# Altium schematic sheet Boost.SchDoc
size A4; SheetNumber: 3; SheetTotal: 6
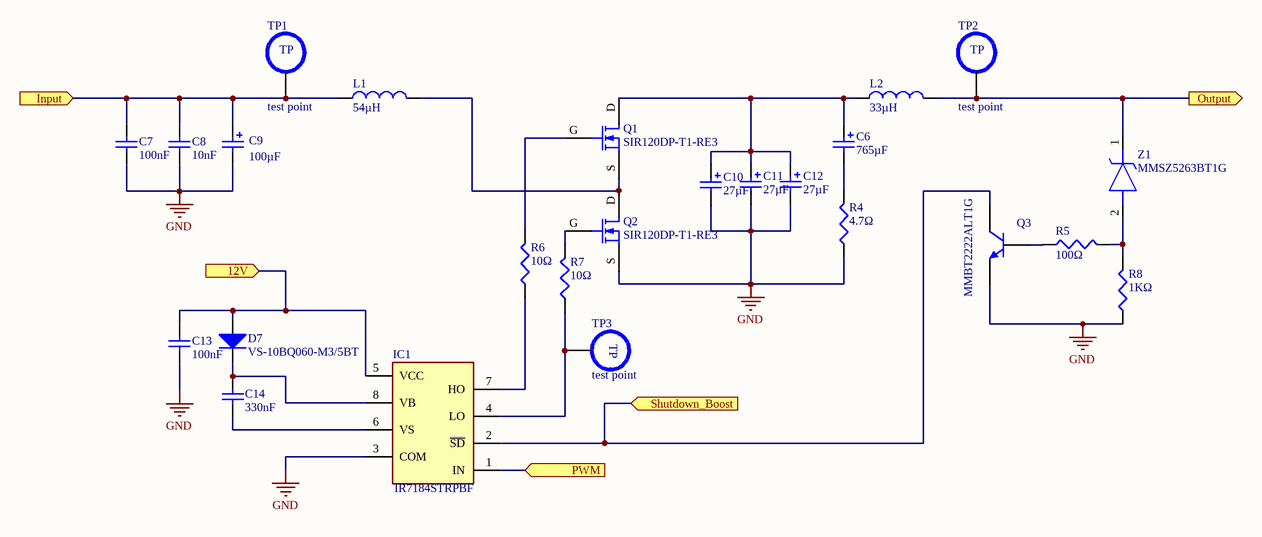
[diagram p0: Boost.SchDoc]

## Parts
C6  765µF  [EEE0JA471UAP]
C7  100nF  [CAPC3216X180N]
C8  10nF  [CAPC3216X180N]
C9  100µF  [EEE0JA471UAP]
C10  27µF  [EEE0JA471UAP]
C11  27µF  [EEE0JA471UAP]
C12  27µF  [EEE0JA471UAP]
C13  100nF  [CAPC3216X180N]
C14  330nF  [CAPC3216X180N]
D7  VS-10BQ060-M3/5BT  [DIOM5436X244N]
IC1  IR7184STRPBF  [SOIC127P600X175-8N]
L1  54µH  [SHBC201R7A0152V]
L2  33µH  [INDPM125125X850N]
Q1  SIR120DP-T1-RE3  [SI7141DPT1GE3]
Q2  SIR120DP-T1-RE3  [SI7141DPT1GE3]
Q3  MMBT2222ALT1G  [SOT96P237X111-3N]
R4  4.7Ω  [RESC3216X75N]
R5  100Ω  [RESC3216X75N]
R6  10Ω  [RESC3216X75N]
R7  10Ω  [RESC3216X75N]
R8  1KΩ  [RESC3216X75N]
TP1  test point  [Test point]
TP2  test point  [Test point]
TP3  test point  [Test point]
Z1  MMSZ5263BT1G  [SOD3716X135N]

## Ports
12V (in), Input (in), Output (out), PWM (in), Shutdown_Boost (in)

## Nets
GND: C7.1 C8.1 C9.2 C10.2 C11.2 C12.2 C13.1 IC1.3(COM) Q2.S Q3.3(E) R4.1 R8.1
12V: C13.2 D7.1(A) IC1.5(VCC) ; port 12V
Input: C7.2 C8.2 C9.1 L1.1 TP1.5 ; port Input
Output: L2.2 TP2.5 Z1.1(K) ; port Output
PWM: IC1.1(IN) ; port PWM
Shutdown_Boost: IC1.2(~{SD}) Q3.1(C) ; port Shutdown_Boost
NetC6_1: C6.1 C10.1 C11.1 C12.1 L2.1 Q1.D
NetC6_2: C6.2 R4.2
NetC14_1: C14.1 IC1.6(VS)
NetC14_2: C14.2 D7.2(K) IC1.8(VB)
NetIC1_4: IC1.4(LO) R7.1 TP3.5
NetIC1_7: IC1.7(HO) R6.1
NetL1_2: L1.2 Q1.S Q2.D
NetQ1_G: Q1.G R6.2
NetQ2_G: Q2.G R7.2
NetQ3_2: Q3.2(B) R5.1
NetR5_2: R5.2 R8.2 Z1.2(A)

## Notes on the sheet
- (in symbol test point) TP

## Library data of the parts
C6 = 765µF: Capacitor Polarised; Manufacturer_Name: Panasonic; Manufacturer_Part_Number: EEV-FK1K101V; Datasheet Link: http://industrial.panasonic.com/cdbs/www-data/pdf/RDE0000/ABA0000C1181.pdf; Height: 14.3mm; Mouser Part Number: 667-EEV-FK1K101V; Mouser Price/Stock: https://www.mouser.co.uk/ProductDetail/Panasonic/EEV-FK1K101V?qs=MtOUKumLmnbTFvRMlB7%2FdA%3D%3D; Value: 765µF
C7 C13 = 100nF: Capacitor; Published: 8-Jun-2000; LatestRevisionDate: 17-Jul-2002; LatestRevisionNote: Re-released for DXP Platform.; PackageReference: RAD-0.3; Publisher: Altium Limited; PackageDescription: Radial Cap, Thru-Hole; 2 Leads; 0.3 in Pin Spacing; Value: 100nF
C8 = 10nF: Capacitor; Published: 8-Jun-2000; LatestRevisionDate: 17-Jul-2002; LatestRevisionNote: Re-released for DXP Platform.; PackageReference: RAD-0.3; Publisher: Altium Limited; PackageDescription: Radial Cap, Thru-Hole; 2 Leads; 0.3 in Pin Spacing; Value: 10nF
C9 = 100µF: Capacitor Polarised; Manufacturer_Name: Panasonic; Manufacturer_Part_Number: EEV-FK1K101V; Datasheet Link: http://industrial.panasonic.com/cdbs/www-data/pdf/RDE0000/ABA0000C1181.pdf; Height: 14.3mm; Mouser Part Number: 667-EEV-FK1K101V; Mouser Price/Stock: https://www.mouser.co.uk/ProductDetail/Panasonic/EEV-FK1K101V?qs=MtOUKumLmnbTFvRMlB7%2FdA%3D%3D
C10-C12 = 27µF: Capacitor Polarised; Manufacturer_Name: Panasonic; Manufacturer_Part_Number: EEV-FK1K101V; Datasheet Link: http://industrial.panasonic.com/cdbs/www-data/pdf/RDE0000/ABA0000C1181.pdf; Height: 14.3mm; Mouser Part Number: 667-EEV-FK1K101V; Mouser Price/Stock: https://www.mouser.co.uk/ProductDetail/Panasonic/EEV-FK1K101V?qs=MtOUKumLmnbTFvRMlB7%2FdA%3D%3D; Value: 27µF
C14 = 330nF: Capacitor; Published: 8-Jun-2000; LatestRevisionDate: 17-Jul-2002; LatestRevisionNote: Re-released for DXP Platform.; PackageReference: RAD-0.3; Publisher: Altium Limited; PackageDescription: Radial Cap, Thru-Hole; 2 Leads; 0.3 in Pin Spacing; Value: 330nF
D7 = Diode: Default Diode; Published: 8-Jun-2000; LatestRevisionDate: 17-Jul-2002; LatestRevisionNote: Re-released for DXP Platform.; PackageVersion: Sep-1996; PackageReference: SMC; Publisher: Altium Limited; PackageDescription: DO-214-AB/SMC; 2 C-Bend Leads; Body 7.9 x 5.9 mm, inc. leads (LxW); Code_JEDEC: DO-214-AB
IC1 = IR7184STRPBF: Integrated Circuit; Manufacturer_Name: Infineon; Datasheet Link: https://componentsearchengine.com/Datasheets/1/IR7184STRPBF.pdf; Height: 1.75mm; Manufacturer_Part_Number: IR7184STRPBF; Mouser Part Number: 942-IR7184STRPBF; Mouser Price/Stock: https://www.mouser.com/Search/Refine.aspx?Keyword=942-IR7184STRPBF; Arrow Part Number: IR7184STRPBF; Arrow Price/Stock: https://www.arrow.com/en/products/ir7184strpbf/infineon-technologies-ag
L1 = 54µH: power inductor
L2 = 33µH: power inductor
Q1 Q2 = SIR120DP-T1-RE3: MOSFET (N-Channel); Manufacturer_Name: Vishay; Datasheet Link: http://www.vishay.com/docs/79731/sir120dp.pdf; Manufacturer_Part_Number: SIR120DP-T1-RE3; Mouser Part Number: 78-SIR120DP-T1-RE3; Mouser Price/Stock: https://www.mouser.co.uk/ProductDetail/Vishay-Semiconductors/SIR120DP-T1-RE3?qs=UkDUCjYnTB3xEXzKpvDZuA%3D%3D; Arrow Part Number: SIR120DP-T1-RE3; Arrow Price/Stock: https://www.arrow.com/en/products/sir120dp-t1-re3/vishay
Q3 = NPN: NPN Bipolar Transistor; Published: 8-Jun-2000; LatestRevisionDate: 17-Jul-2002; LatestRevisionNote: Re-released for DXP Platform.; PackageReference: TO-226-AA; Publisher: Altium Limited; PackageDescription: TO, Flat Index; 3 In-Line, Axial Leads; Body Dia. 4.8mm; Leads 0.55 x 0.51 mm (max); Code_JEDEC: TO-226-AA
R4 = 4.7Ω: Resistor; Published: 8-Jun-2000; LatestRevisionDate: 29-May-2009; LatestRevisionNote: IPC-7351 Footprint Added.; PackageReference: J1-0603; Publisher: Altium Limited; PackageDescription: Chip Resistor
R5 = 100Ω: Resistor; Published: 8-Jun-2000; LatestRevisionDate: 29-May-2009; LatestRevisionNote: IPC-7351 Footprint Added.; PackageReference: J1-0603; Publisher: Altium Limited; PackageDescription: Chip Resistor
R6 R7 = 10Ω: Resistor; Published: 8-Jun-2000; LatestRevisionDate: 29-May-2009; LatestRevisionNote: IPC-7351 Footprint Added.; PackageReference: J1-0603; Publisher: Altium Limited; PackageDescription: Chip Resistor
R8 = 1KΩ: Resistor; Published: 8-Jun-2000; LatestRevisionDate: 29-May-2009; LatestRevisionNote: IPC-7351 Footprint Added.; PackageReference: J1-0603; Publisher: Altium Limited; PackageDescription: Chip Resistor
Z1 = MMSZ5263BT1G: Zener Diode; Manufacturer_Name: ON Semiconductor; Datasheet Link: http://www.onsemi.com/pub/Collateral/MMSZ5221BT1-D.PDF; Height: 1.35mm; Manufacturer_Part_Number: MMSZ5263BT1G; Mouser Part Number: 863-MMSZ5263BT1G; Mouser Price/Stock: https://www.mouser.co.uk/ProductDetail/onsemi/MMSZ5263BT1G?qs=ZpPixqFcBtxaamSEBIiIIg%3D%3D; Arrow Part Number: MMSZ5263BT1G; Arrow Price/Stock: https://www.arrow.com/en/products/mmsz5263bt1g/on-semiconductor?region=nac